# Altium schematic sheet MCU.SchDoc
size A
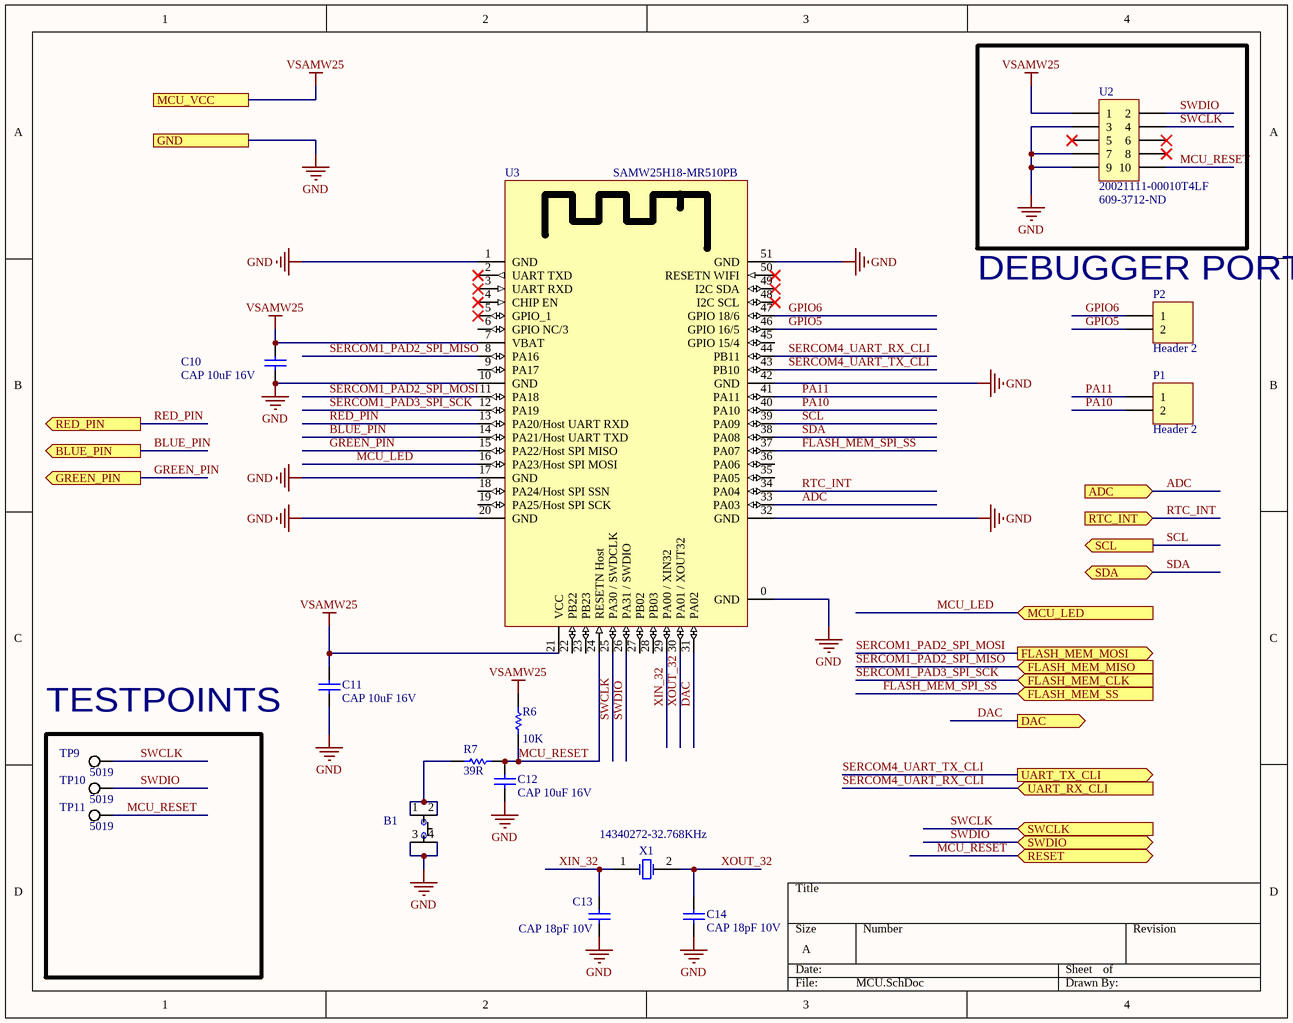
[diagram p0: MCU.SchDoc]

## Parts
B1  PTS810 SJK 250 SMTR LFS  [PTS810 SJK 250 SMTR LFS]  (value not drawn)
C10  CAP 10uF 16V  [CAPC0805(2012)145_L]
C11  CAP 10uF 16V  [CAPC0805(2012)145_L]
C12  CAP 10uF 16V  [CAPC0805(2012)145_L]
C13  CAP 18pF 10V  [CAPC0805(2012)75_L]
C14  CAP 18pF 10V  [CAPC0805(2012)75_L]
P1  Header 2  [HDR1X2]  (no BOM)
P2  Header 2  [HDR1X2]  (no BOM)
R6  value 10K  [J1-0603]
R7  39R  [RESC0805(2012)_N]
TP9  5019  [KSTN-5019_V]  (no BOM)
TP10  5019  [KSTN-5019_V]  (no BOM)
TP11  5019  [KSTN-5019_V]  (no BOM)
U2  20021111-00010T4LF  Supplier Part Number 1: 609-3712-ND  [20021111-00010T4LF]
U3  SAMW25H18-MR510PB  [SAMW25H18-MR510PB]
X1  14340272-32.768KHz  [ITTI-14340272-32.768KHz-2_V]

## Blocks framed on the sheet
TESTPOINTS: TP9-TP11

## Ports
ADC (in), BLUE_PIN (out), DAC (out), FLASH_MEM_CLK (in), FLASH_MEM_MISO (in), FLASH_MEM_MOSI (out), FLASH_MEM_SS (in), GND, GREEN_PIN (out), MCU_LED (in), MCU_VCC, RED_PIN (out), RESET (bidir), RTC_INT (in), SCL (out), SDA (bidir), SWCLK (in), SWDIO (bidir), UART_RX_CLI (in), UART_TX_CLI (out)

## Nets
GND: B1.3 B1.4 C10.1 C11.1 C12.1 C13.2 C14.2 U2.3 U2.7 U2.9 U3.0(GND) U3.1(GND) U3.10(GND) U3.17(GND) U3.20(GND) U3.32(GND) U3.42(GND) U3.51(GND) ; port GND
VSAMW25: C10.2 C11.2 R6.2 U2.1 U3.7(VBAT) U3.21(VCC) ; port MCU_VCC
ADC: U3.33(PA03) ; port ADC
BLUE_PIN: U3.14(PA21/Host_UART_TXD) ; port BLUE_PIN
DAC: U3.31(PA02) ; port DAC
FLASH_MEM_SPI_SS: U3.37(PA07) ; port FLASH_MEM_SS
GPIO5: P2.2 U3.46(GPIO_16/5)
GPIO6: P2.1 U3.47(GPIO_18/6)
GREEN_PIN: U3.15(PA22/Host_SPI_MISO) ; port GREEN_PIN
MCU_LED: U3.16(PA23/Host_SPI_MOSI) ; port MCU_LED
MCU_RESET: C12.2 R6.1 R7.1 TP11.1 U2.10 U3.24(RESETN_Host) ; port RESET
PA10: P1.2 U3.40(PA10)
PA11: P1.1 U3.41(PA11)
RED_PIN: U3.13(PA20/Host_UART_RXD) ; port RED_PIN
RTC_INT: U3.34(PA04) ; port RTC_INT
SCL: U3.39(PA09) ; port SCL
SDA: U3.38(PA08) ; port SDA
SERCOM1_PAD2_SPI_MISO: U3.8(PA16) ; port FLASH_MEM_MISO
SERCOM1_PAD2_SPI_MOSI: U3.11(PA18) ; port FLASH_MEM_MOSI
SERCOM1_PAD3_SPI_SCK: U3.12(PA19) ; port FLASH_MEM_CLK
SERCOM4_UART_RX_CLI: U3.44(PB11) ; port UART_RX_CLI
SERCOM4_UART_TX_CLI: U3.43(PB10) ; port UART_TX_CLI
SWCLK: TP9.1 U2.4 U3.25(PA30_/_SWDCLK) ; port SWCLK
SWDIO: TP10.1 U2.2 U3.26(PA31_/_SWDIO) ; port SWDIO
XIN_32: C13.1 U3.29(PA00_/_XIN32) X1.1(X1)
XOUT_32: C14.1 U3.30(PA01_/_XOUT32) X1.2(X2)
NetB1_1: B1.1 B1.2 R7.2

Not connected (* = marked no-connect by the designer): U2 5* 6* 8*; U3 2(UART_TXD)* 3(UART_RXD)* 4(CHIP_EN)* 5(GPIO_1)* 6(GPIO_NC/3) 9(PA17) 18(PA24/Host_SPI_SSN) 19(PA25/Host_SPI_SCK) 22(PB22) 23(PB23) 27(PB02) 28(PB03) 35(PA05) 36(PA06) 45(GPIO_15/4) 48(I2C_SCL)* 49(I2C_SDA)* 50(RESETN_WIFI)*

## Notes on the sheet
- (near P2) DEBUGGER PORT

## Library data of the parts
B1 = PTS810 SJK 250 SMTR LFS: SWITCH TACTILE SPST-NO 0.05A 16V Tactile Switch SPST-NO Top Actuated Surface Mount; Manufacturer: ITT /  C&K Components; Part # Aliases: Y97LT25B5DBFP; Operating Force: 2.6 N; Actuator: Oval; Current Rating: 50 mA; Voltage Rating DC: 16 VDC; Contact Form: SPST; Switch Function: OFF - (ON); Mounting Direction: Straight; Stem Height: 2.5 mm; Brand: C&K Components; Travel: 0.15 mm; Manufacturer Part Number: PTS810SJK250SMTRLFS; Product Category: Tactile Switches; RoHS: Details; Termination Style: J Form Lead; Mounting Style: SMD/SMT; Color: White; Packaging: Reel; Contact Plating: Silver; Operating Temperature Range: - 40 C to + 85 C; Series: PTS810; Factory Pack Quantity: 2900; ComponentLink1URL: https://datasheet.ciiva.com/18514/pts810-4mar13-18514061.pdf; ComponentLink1Description: https://datasheet.ciiva.com/18514/pts810-4mar13-18514061.pdf; ComponentLink2URL: https://datasheet.ciiva.com/18514/pts810-4mar13-18514062.pdf; ComponentLink2Description: https://datasheet.ciiva.com/18514/pts810-4mar13-18514062.pdf; ComponentLink3URL: https://datasheet.ciiva.com/18514/pts810-4mar13-18514063.pdf; ComponentLink3Description: https://datasheet.ciiva.com/18514/pts810-4mar13-18514063.pdf; Supplier 1: Digi-Key; Supplier Part Number 1: CKN10503CT-ND
C10-C12 = CMP-1036-04927-1: CAP 10uF 16V ±10% 0805 (2012 Metric) Thickness 1.45mm SMD; Case-EIA: 0805; Tolerance: Â±10%; Case-Metric: 2012; Rated Voltage: 16 V; Technology: SMT; Value: 10uF; Max Thickness: 1.45 mm
C13 C14 = CMP-1036-01106-1: CAP 18pF 10V ±1% 0805 (2012 Metric) Thickness 0.75mm SMD; Tolerance: Â±1%; Case-Metric: 2012; Case-EIA: 0805; Technology: SMT; Rated Voltage: 10 V; Value: 18pF; Max Thickness: 0.75 mm
P1 P2 = Header 2: Header, 2-Pin; LatestRevisionDate: 17-Jul-2002; LatestRevisionNote: Re-released for DXP Platform.; Publisher: Altium Limited
R6 = Res1: Resistor; Published: 8-Jun-2000; LatestRevisionDate: 17-Jul-2002; LatestRevisionNote: Re-released for DXP Platform.; PackageReference: AXIAL-0.3; Publisher: Altium Limited; PackageDescription: Axial Device, Thru-Hole; 2 Leads; 0.3 in Pin Spacing
R7 = CMP-1013-00040-1: 39R 0.125W 5% 0805 (2012 Metric)  SMD; Value: 39.00 Ohm; Case-EIA: 0805; Case-Metric: 2012; Technology: SMT; Power: 0.125 W; Tolerance: 5 %
TP9-TP11 = CMP-1672-00008-1: Test Point, 1 Position SMD, RoHS, Tape and Reel; ComponentLink1Description: Manufacturer URL; Package Quantity: 1000; DatasheetVersion: 03/2014; Packaging: Tape and Reel; ComponentLink2URL: http://www.keyelco.com/product-pdf.cfm?p=1357; ComponentLink1URL: http://www.keyelco.com/; Mount: Surface Mount; Contact Plating: Silver; PackageDescription: 1-Pin Surface Mount Device, Body 3.81 x 2.03 mm; Pins: 1; RoHSCompliant: True; Mounting Technology: Surface Mount; ComponentLink2Description: Datasheet; PackageReference: 5019
U2 = 20021111-00010T4LF: CONN HEADER 10POS UNSHD VERT T/H; Manufacturer: Amphenol / FCI; Stack Height: 2.5 mm; Number of Positions / Contacts: 10; Brand: FCI; Pitch: 1.27 mm; Mounting Angle: Vertical; Current Rating: 10 A; Mating Post Length: 3.05 mm; Voltage Rating: 125 V; Manufacturer Part Number: 20021111-00010T4LF; Mounting Style: Through Hole; Product Category: Headers & Wire Housings; RoHS: Details; Series: Minitek; Product Type: Headers; Type: Unshrouded; Number of Positions: 10; Number of Rows: 2; Contact Plating: Gold; Housing Material: Plastic; Termination Style: Through Hole; Contact Material: Nickel; Packaging: Tube; Factory Pack Quantity: 93; Termination Post Length: 2.3 mm; ComponentLink1URL: https://datasheet.ciiva.com/1433/1079612-1433267.pdf; ComponentLink1Description: https://datasheet.ciiva.com/1433/1079612-1433267.pdf; ComponentLink2URL: https://datasheet.ciiva.com/409/20021111-409158.pdf; ComponentLink2Description: https://datasheet.ciiva.com/409/20021111-409158.pdf; ComponentLink3URL: https://datasheet.ciiva.com/5131/20021111-5131386.pdf; ComponentLink3Description: https://datasheet.ciiva.com/5131/20021111-5131386.pdf; ComponentLink4URL: https://datasheet.ciiva.com/9465/20021111-9465402.pdf; ComponentLink4Description: https://datasheet.ciiva.com/9465/20021111-9465402.pdf; Supplier 1: Digi-Key
U3 = SAMW25H18-MR510PB: RF TXRX MODULE WIFI TRACE ANT; Manufacturer: Atmel; Manufacturer Part Number: ATSAMW25H18-MR510PB; Protocol: 802.11b/g/n; Frequency: 2.4GHz; Data Rate: 65Mbps; Power - Output: 17dBm; Sensitivity: -95.5dBm; Serial Interfaces: SPI, UART; Antenna Type: Integrated, Trace; Memory Size: 256kB Flash, 32kB SRAM; Voltage - Supply: 2.7 V ~ 4.2 V; Category: RF/IF and RFID; Family: RF Transceiver Modules; Series: Xplained Pro; Packaging: Tray; RF Family/Standard: WiFi; Modulation: -; Current - Receiving: -; Current - Transmitting: -; Mounting Type: Surface Mount; Operating Temperature: -40°C ~ 85°C; Package / Case: Module; ComponentLink1URL: http://www.atmel.com/devices/ATSAMW25.aspx; ComponentLink1Description: http://www.atmel.com/devices/ATSAMW25.aspx; ComponentLink2URL: http://www.farnell.com/datasheets/1965115.pdf; ComponentLink2Description: http://www.farnell.com/datasheets/1965115.pdf; Supplier 1: Digikey; Stock 1: 120; Pricing 1: 1=19.14 (USD); Supplier Part Number 1: ATSAMW25H18-MR510PB-ND
X1 = CMP-0463-00001-2: Crystal, 32.768 KHz, -40 to 85 degC, 3.2 x 1.5 x 0.9 mm SMD; Manufacturer: ITTI; Load Capacitance: 12.5 pF; Frequency Tolerance: +/-20 ppm; Drive Level: 1 max. uw; Nominal Frequency: 32.768KHz; Mounting Technology: Surface Mount; Operating temperature: -40 to 85 degC; PartNumber: 14340272-32.768KHz; ComponentLink1URL: http://www.itti-co.com; ComponentLink1Description: Manufacturer URL; PackageReference: 14340272-32.768KHz-2; PackageDescription: 2-Pin Hand Drawn, Body 3.2 x 1.5mm, Pitch 2.5 mm